# EasyEDA Pro project Keithley 2000 Omron SCAN V1.0.epro

# Schematic Keithley 2000 Omron SCAN V1.0
Board Name: Keithley 2000 SCAN V1.0; Create Date: 2026-03-19; Page Name: Main; Project Name: SCAN2000; Schematic Name: Keithley 2000 SCAN V1.0; Update Date: 2026-03-20; Company: EasyEDA.com; Page Size: A4; Version: V1.0
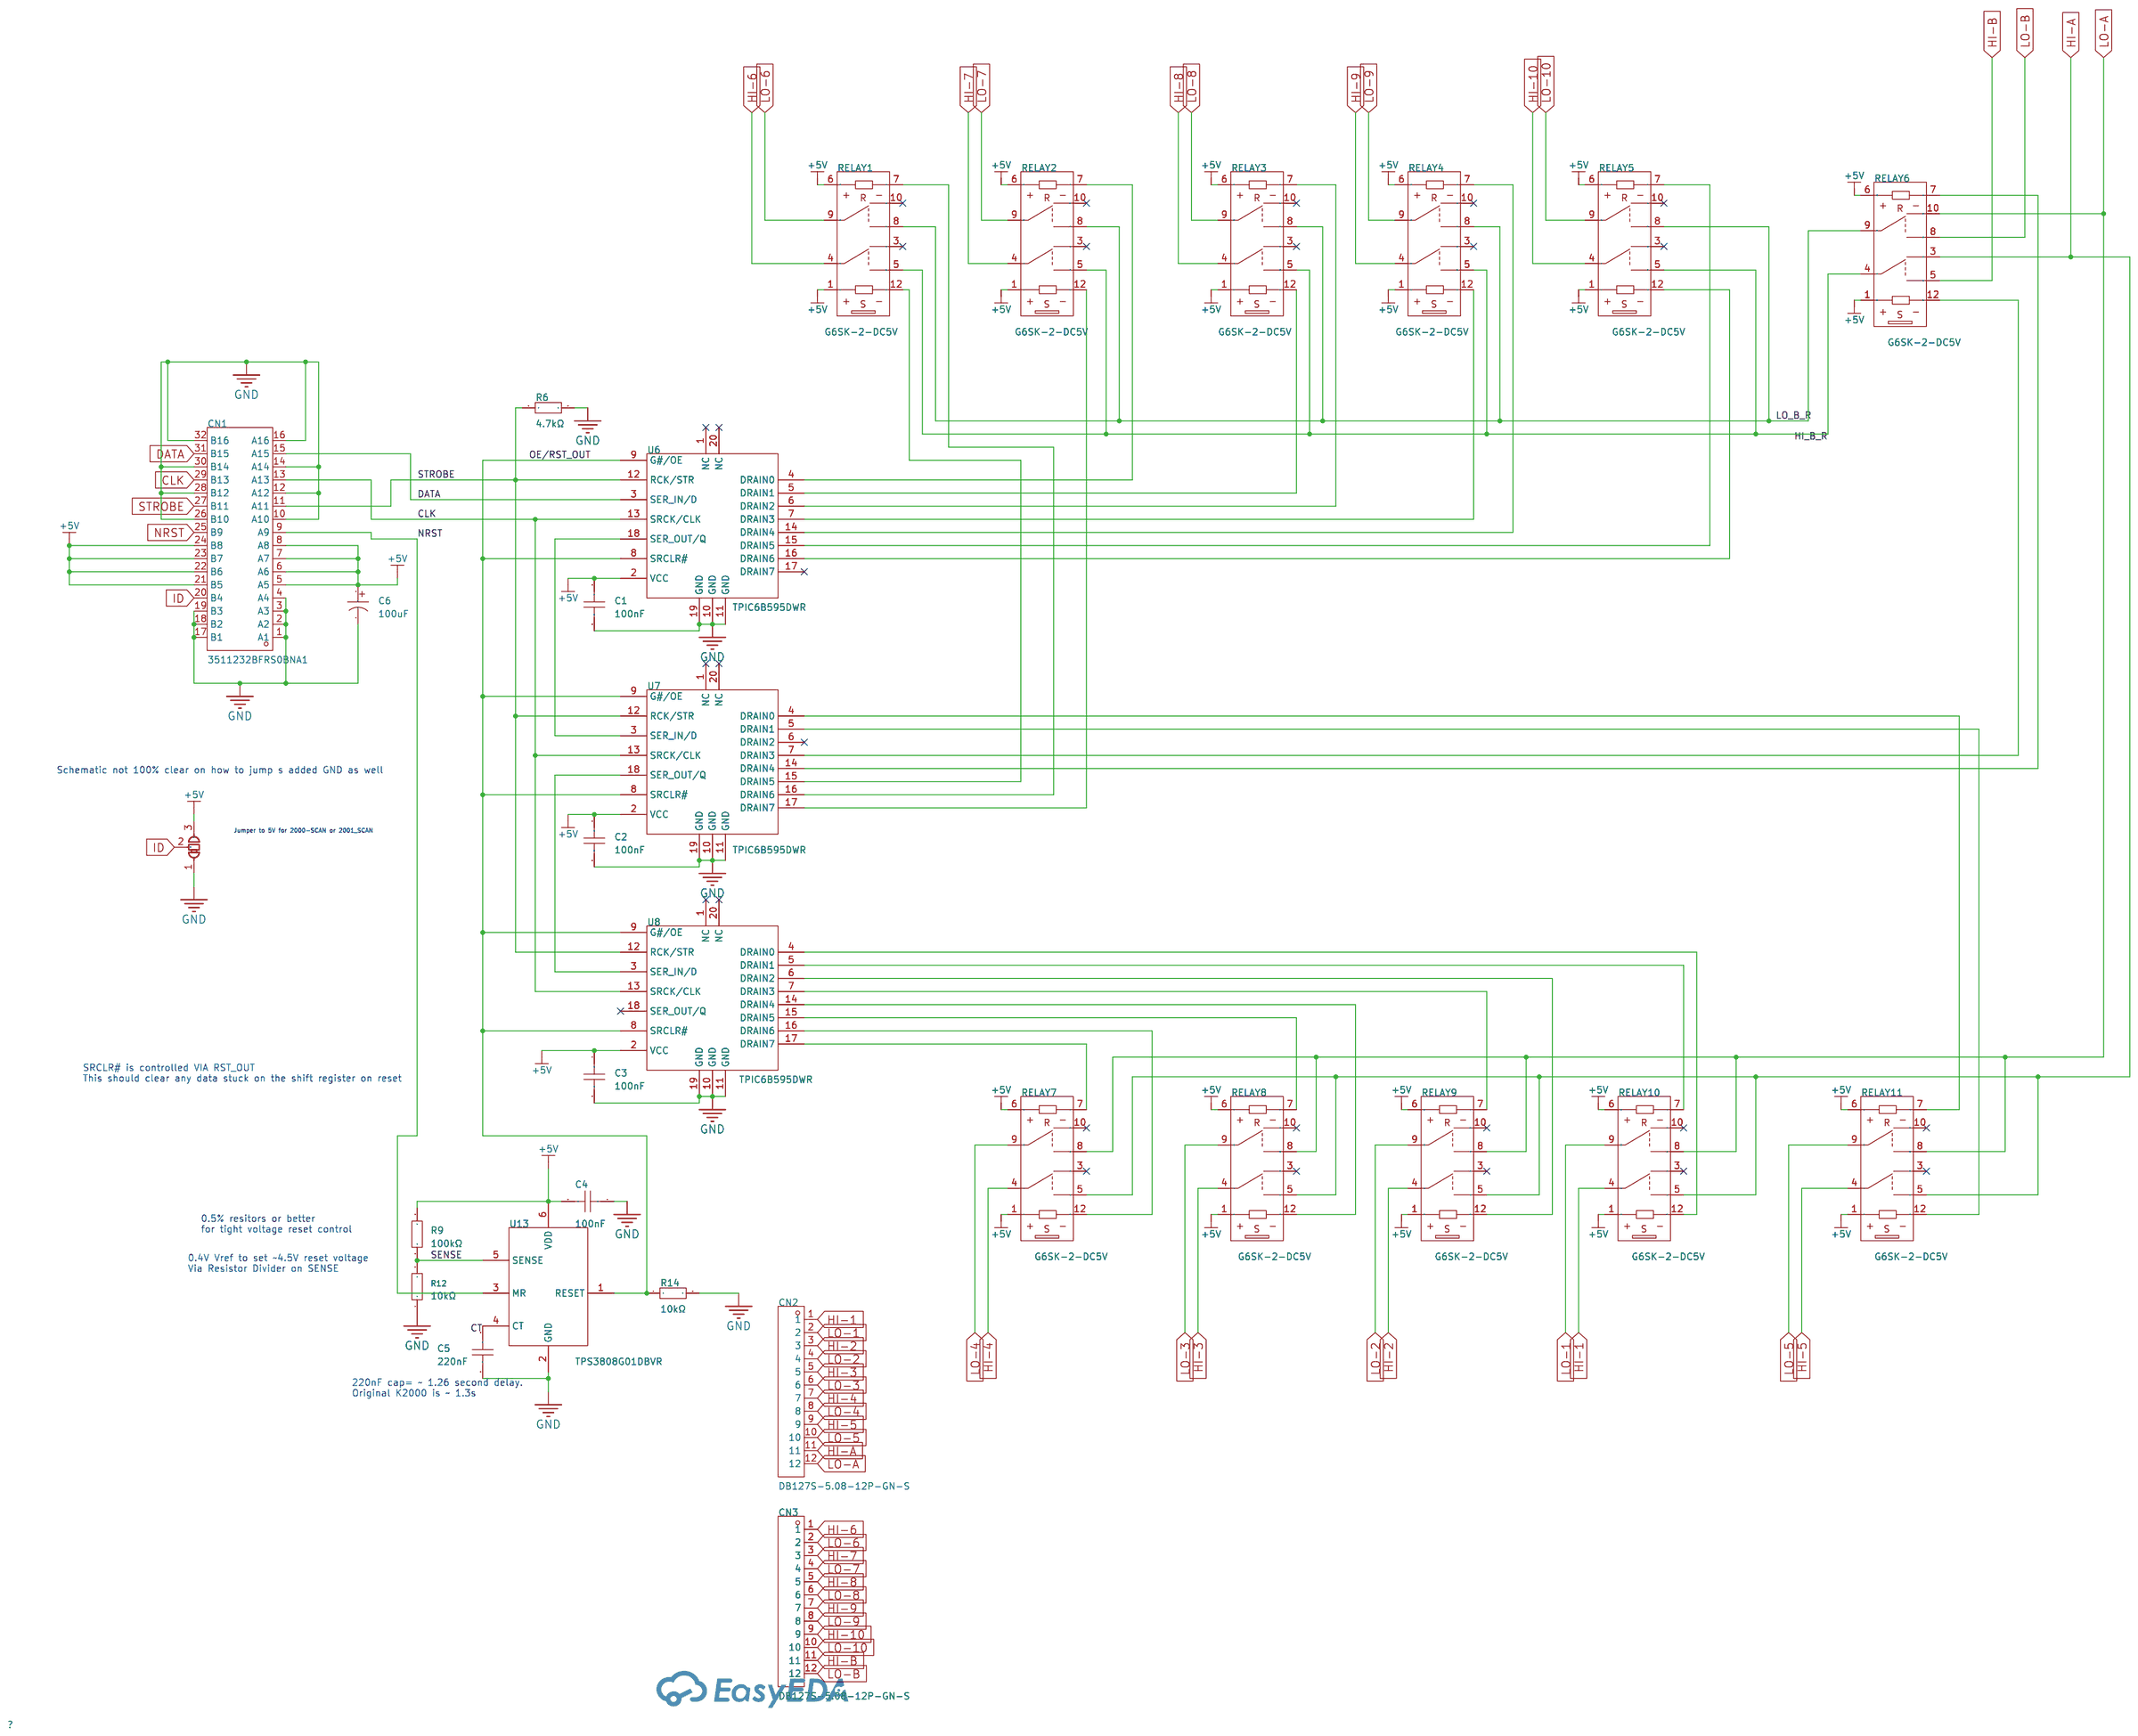
[diagram p0: schematic sheet]

## Parts
C1  100nF  [C0603]
C2  100nF  [C0603]
C3  100nF  [C0603]
C4  100nF  [C0603]
C5  220nF  [C0603]
C6  100uF  [CAP-TH_BD8.0-P3.50-D0.6-FD]
CN1  3511232BFRS0BNA1  [CONN-TH_3511232BFRS0BNA1]
CN2  DB127S-5.08-12P-GN-S  [CONN-TH_12P-P5.08_DB127S-5.08-12P-GN-S]
CN3  DB127S-5.08-12P-GN-S  [CONN-TH_12P-P5.08_DB127S-5.08-12P-GN-S]
JP1  SolderJumper_3_Bridged12  [Jumper:SolderJumper-3_P1.3mm_Bridged12_Pad1.0x1.5mm_NumberLabels]
R6  4.7kΩ  [R0603]
R9  100kΩ  [R0603]
R12  10kΩ  [R0603]
R14  10kΩ  [R0603]
RELAY1  G6SK-2-DC5V  [RELAY-TH_G6SK-2-XXX]
RELAY2  G6SK-2-DC5V  [RELAY-TH_G6SK-2-XXX]
RELAY3  G6SK-2-DC5V  [RELAY-TH_G6SK-2-XXX]
RELAY4  G6SK-2-DC5V  [RELAY-TH_G6SK-2-XXX]
RELAY5  G6SK-2-DC5V  [RELAY-TH_G6SK-2-XXX]
RELAY6  G6SK-2-DC5V  [RELAY-TH_G6SK-2-XXX]
RELAY7  G6SK-2-DC5V  [RELAY-TH_G6SK-2-XXX]
RELAY8  G6SK-2-DC5V  [RELAY-TH_G6SK-2-XXX]
RELAY9  G6SK-2-DC5V  [RELAY-TH_G6SK-2-XXX]
RELAY10  G6SK-2-DC5V  [RELAY-TH_G6SK-2-XXX]
RELAY11  G6SK-2-DC5V  [RELAY-TH_G6SK-2-XXX]
U6  TPIC6B595DWR  [SOIC-20_L13.0-W7.6-P1.27-LS10.3-BL]
U7  TPIC6B595DWR  [SOIC-20_L13.0-W7.6-P1.27-LS10.3-BL]
U8  TPIC6B595DWR  [SOIC-20_L13.0-W7.6-P1.27-LS10.3-BL]
U13  TPS3808G01DBVR  [SOT-23-6_L2.9-W1.6-P0.95-LS2.8-BR]

## Library data of the parts
C1-C4 = CL10B104KB8NNNC: Capacitance:100nF Tolerance:±10% Tolerance:±10% Voltage Rating:50V Temperature Coefficient:X7R; LCSC Part Name: 100nF ±10% 50V; Supplier Part: C1591; Manufacturer: SAMSUNG(三星); Supplier Footprint: 0603; JLCPCB Part Class: Extended Part; Datasheet: https://item.szlcsc.com/datasheet/CL10B104KB8NNNC/1943.html; Supplier: LCSC; Tolerance: ±10%; Voltage Rating: 50V; Temperature Coefficient: X7R
C5 = CL10B224KA8NNNC: Capacitance:220nF Tolerance:±10% Tolerance:±10% Voltage Rating:25V Temperature Coefficient:X7R; LCSC Part Name: 220nF ±10% 25V; Supplier Part: C21120; Manufacturer: SAMSUNG(三星); Supplier Footprint: 0603; JLCPCB Part Class: Basic Part; Datasheet: https://item.szlcsc.com/datasheet/CL10B224KA8NNNC/21832.html; Supplier: LCSC; Tolerance: ±10%; Voltage Rating: 25V; Temperature Coefficient: X7R
C6 = ERJ1HM101F12OT: Capacitance:100uF Tolerance:±20% Tolerance:±20% Voltage Rating:50V Ripple Current:950mA@100kHz Equivalent Series Resistance(ESR):120mΩ@100kHz Pin Spacing:3.5mm Diameter:8mm Height - Seated (Max):12mm Lifetime:10000hrs@105℃; LCSC Part Name: 100uF ±20% 50V; Supplier Part: C106559; Manufacturer: AISHI(艾华集团); Supplier Footprint: 插件,D8xL12mm; Datasheet: https://item.szlcsc.com/datasheet/ERJ1HM101F12OT/107775.html; Supplier: LCSC; Tolerance: ±20%; Voltage Rating: 50V; Ripple Current: 950mA@100kHz; Equivalent Series Resistance(ESR): 120mΩ@100kHz; Pin Spacing: 3.5mm; Diameter: 8mm; Height - Seated (Max): 12mm; Lifetime: 10000hrs@105℃
CN1 = 3511232BFRS0BNA1: Number of Pins:32P Pitch:2.54mm Mounting Type:Right Angle Number of Rows:2 Current Rating:3A Contact Material:Brass Contact Plating:Gold Operating Temperature:-40℃~+105℃ Operating Temperature:-40℃~+105℃; LCSC Part Name: PIN:32P 间距:2.54mm 弯插; Supplier Part: C963692; Manufacturer: JILN(锦凌); Supplier Footprint: 弯插,P=2.54mm; Datasheet: https://item.szlcsc.com/datasheet/3511232BFRS0BNA1/1048125.html; Supplier: LCSC; Number of Pins: 32P; Pitch: 2.54mm; Mounting Type: Right Angle; Number of Rows: 2; Current Rating: 3A; Contact Material: Brass; Contact Plating: Gold; Operating Temperature: -40℃~+105℃
CN2 CN3 = DB127S-5.08-12P-GN-S: Number of Positions or Pins:1x12P Pitch:5.08mm Color:Green Mounting Type:Through Hole Number of Pins:12P Number of Rows:1 Number of PINs Per Row:12 Screw Specification:M3 Current Rating:12A Voltage Rating (Max):300V Wire Gauge - AWG:14~26 Wire Gauge - mm2; LCSC Part Name: 1x12P 5.08mm 直插 排数:1 每排P数:12; Supplier Part: C18198311; Manufacturer: DORABO(地博电气); Supplier Footprint: 插件,P=5.08mm; JLCPCB Part Class: Extended Part; Datasheet: https://item.szlcsc.com/datasheet/DB127S-5.08-12P-GN-S/19349685.html; Supplier: LCSC; Number of Positions or Pins: 1x12P; Pitch: 5.08mm; Color: Green; Mounting Type: Through Hole; Number of Pins: 12P; Number of Rows: 1; Number of PINs Per Row: 12; Screw Specification: M3; Current Rating: 12A; Voltage Rating (Max): 300V; Wire Gauge - AWG: 14~26; Wire Gauge - mm2: 1.5; Operating Temperature: -40℃~+105℃
JP1 = Jumper_SolderJumper_3_Bridged12: 3-pole Solder Jumper, pins 1+2 closed/bridged; Attribute1: 1; Attribute2: 3; DNP: 1
R6 = RC0603FR-074K7L: Type:Thick Film Resistor Resistance:4.7kΩ Tolerance:±1% Tolerance:±1% Power(Watts):100mW Voltage-Supply(Max):75V Temperature Coefficient:±100ppm/℃ Temperature Coefficient:±100ppm/℃ Operating Temperature:-55℃~+155℃ Operating Temperature:-55℃~+155℃; LCSC Part Name: 厚膜电阻 4.7kΩ ±1% 100mW; Supplier Part: C99782; Manufacturer: YAGEO(国巨); Supplier Footprint: 0603; JLCPCB Part Class: Extended Part; Datasheet: https://item.szlcsc.com/datasheet/RC0603FR-074K7L/100996.html; Supplier: LCSC; Type: Thick Film Resistor; Tolerance: ±1%; Power(Watts): 100mW; Voltage-Supply(Max): 75V; Temperature Coefficient: ±100ppm/℃; Operating Temperature: -55℃~+155℃
R9 = AR03DTCX1003: Type:Thin Film Resistor Resistance:100kΩ Tolerance:±0.5% Tolerance:±0.5% Power(Watts):100mW Voltage-Supply(Max):75V Temperature Coefficient:±25ppm/℃ Temperature Coefficient:±25ppm/℃ Operating Temperature:-55℃~+155℃ Operating Temperature:-55℃~+155℃; LCSC Part Name: 薄膜电阻 100kΩ ±0.5% 100mW; Supplier Part: C319967; Manufacturer: Viking(光颉); Supplier Footprint: 0603; Datasheet: https://item.szlcsc.com/datasheet/AR03DTCX1003/301037.html; Supplier: LCSC; Type: Thin Film Resistor; Tolerance: ±0.5%; Power(Watts): 100mW; Voltage-Supply(Max): 75V; Temperature Coefficient: ±25ppm/℃; Operating Temperature: -55℃~+155℃
R12 = 0603WAD1002T5E: Type:Thick Film Resistor Resistance:10kΩ Tolerance:±0.5% Tolerance:±0.5% Power(Watts):100mW Voltage-Supply(Max):75V Temperature Coefficient:±100ppm/℃ Temperature Coefficient:±100ppm/℃ Operating Temperature:-55℃~+155℃ Operating Temperature:-55℃~+155℃; LCSC Part Name: 10kΩ ±0.5% 100mW 厚膜电阻; Supplier Part: C167144; Manufacturer: UNI-ROYAL(厚声); Supplier Footprint: 0603; JLCPCB Part Class: Extended Part; Datasheet: https://item.szlcsc.com/datasheet/0603WAD1002T5E/178527.html; Supplier: LCSC; Type: Thick Film Resistor; Tolerance: ±0.5%; Power(Watts): 100mW; Voltage-Supply(Max): 75V; Temperature Coefficient: ±100ppm/℃; Operating Temperature: -55℃~+155℃
R14 = RC0603FR-0710KL: Type:Thick Film Resistors Resistance: Tolerance:±1% Tolerance:±1% Power(Watts): Overload Voltage (Max): Temperature Coefficient:±100ppm/℃ Temperature Coefficient:±100ppm/℃ Operating Temperature Range:-55℃~+155℃ Operating Temperature Range:-55℃~+155℃; LCSC Part Name: 厚膜电阻 10kΩ ±1% 100mW; Supplier Part: C98220; Manufacturer: YAGEO(国巨); Supplier Footprint: 0603; JLCPCB Part Class: Extended Part; Datasheet: https://atta.szlcsc.com/upload/public/pdf/source/20180927/C295883_E8D83085EA81BD7DE0B2B681138C15EE.pdf; Supplier: LCSC; Type: Thick Film Resistors; Tolerance: ±1%; Temperature Coefficient: ±100ppm/℃; Operating Temperature Range: -55℃~+155℃
RELAY1-RELAY11 = G6SK-2-DC5V: Supplier Part: C2931106; Manufacturer: OMRON(欧姆龙); Supplier Footprint: DIP,14.8x7.3mm; JLCPCB Part Class: Extended Part; Supplier: LCSC
U6-U8 = TPIC6B595DWR: Function:Serial-to-Serial or Parallel Voltage - Supply:4.5V~5.5V Voltage - Supply:4.5V~5.5V Clock Frequency:- Number of Elements:1 Number of Bits per Element:- Output Type:Open Drain Series:TPIC Operating Temperature:-40℃~+125℃ Operating Temperature:-40℃~; LCSC Part Name: 开路漏极输出 8位串行至串行或并行移位寄存器; Supplier Part: C7094; Manufacturer: TI(德州仪器); Supplier Footprint: SOIC-20-300mil; JLCPCB Part Class: Extended Part; Datasheet: https://www.ti.com/cn/lit/gpn/tpic6b595; Supplier: LCSC; Function: Serial-to-Serial or Parallel; Voltage - Supply: 4.5V~5.5V; Number of Elements: 1; Output Type: Open Drain; Series: TPIC; Operating Temperature: -40℃~+125℃
U13 = TPS3808G01DBVR: ChipType:Voltage monitor Output Type:Open Drain Voltage - Supply:1.7V~6.5V Voltage - Supply:1.7V~6.5V Reset Active Level:Active Low Threshold Voltage:405mV Number of Voltages Monitored:1 Manual Reset:Yes Watchdog:No Reset Timeout:20us Operating Temperatur; LCSC Part Name: 低静态电流可编程延迟监控电路; Supplier Part: C19653; Manufacturer: TI(德州仪器); Supplier Footprint: SOT-23-6; JLCPCB Part Class: Extended Part; Datasheet: https://www.ti.com/cn/lit/gpn/tps3808; Supplier: LCSC; ChipType: Voltage monitor; Output Type: Open Drain; Voltage - Supply: 1.7V~6.5V; Reset Active Level: Active Low; Threshold Voltage: 405mV; Number of Voltages Monitored: 1; Manual Reset: Yes; Watchdog: No; Reset Timeout: 20us; Operating Temperature: -40℃~+125℃@(Tj)

## Nets
+5V: C1.1 C2.1 C3.1 C4.2 C6.1 CN1.5(A5) CN1.6(A6) CN1.7(A7) CN1.8(A8) CN1.21(B5) CN1.22(B6) CN1.23(B7) CN1.24(B8) JP1.3(B) R9.2 RELAY1.1 RELAY1.6 RELAY2.1 RELAY2.6 RELAY3.1 RELAY3.6 RELAY4.1 RELAY4.6 RELAY5.1 RELAY5.6 RELAY6.1 RELAY6.6 RELAY7.1 RELAY7.6 RELAY8.1 RELAY8.6 RELAY9.1 RELAY9.6 RELAY10.1 RELAY10.6 RELAY11.1 RELAY11.6 U6.2(VCC) U7.2(VCC) U8.2(VCC) U13.6(VDD)
GND: C1.2 C2.2 C3.2 C4.1 C5.2 C6.2 CN1.1(A1) CN1.2(A2) CN1.3(A3) CN1.4(A4) CN1.10(A10) CN1.12(A12) CN1.14(A14) CN1.16(A16) CN1.17(B1) CN1.18(B2) CN1.19(B3) CN1.26(B10) CN1.28(B12) CN1.30(B14) CN1.32(B16) JP1.1(A) R6.2 R12.1 R14.2 U6.10(GND) U6.11(GND) U6.19(GND) U7.10(GND) U7.11(GND) U7.19(GND) U8.10(GND) U8.11(GND) U8.19(GND) U13.2(GND)
CLK: CN1.13(A13) CN1.29(B13) U6.13(SRCK/CLK) U7.13(SRCK/CLK) U8.13(SRCK/CLK)
CT: C5.1 U13.4(CT)
DATA: CN1.15(A15) CN1.31(B15) U6.3(SER IN/D)
HI-1: CN2.1 RELAY10.4
HI-2: CN2.3 RELAY9.4
HI-3: CN2.5 RELAY8.4
HI-4: CN2.7 RELAY7.4
HI-5: CN2.9 RELAY11.4
HI-6: CN3.1 RELAY1.4
HI-7: CN3.3 RELAY2.4
HI-8: CN3.5 RELAY3.4
HI-9: CN3.7 RELAY4.4
HI-10: CN3.9 RELAY5.4
HI-A: CN2.11 RELAY6.3 RELAY7.5 RELAY8.5 RELAY9.5 RELAY10.5 RELAY11.5
HI-B: CN3.11 RELAY6.5
HI_B_R: RELAY1.5 RELAY2.5 RELAY3.5 RELAY4.5 RELAY5.5 RELAY6.4
ID: CN1.20(B4) JP1.2(C)
LO-1: CN2.2 RELAY10.9
LO-2: CN2.4 RELAY9.9
LO-3: CN2.6 RELAY8.9
LO-4: CN2.8 RELAY7.9
LO-5: CN2.10 RELAY11.9
LO-6: CN3.2 RELAY1.9
LO-7: CN3.4 RELAY2.9
LO-8: CN3.6 RELAY3.9
LO-9: CN3.8 RELAY4.9
LO-10: CN3.10 RELAY5.9
LO-A: CN2.12 RELAY6.10 RELAY7.8 RELAY8.8 RELAY9.8 RELAY10.8 RELAY11.8
LO-B: CN3.12 RELAY6.8
LO_B_R: RELAY1.8 RELAY2.8 RELAY3.8 RELAY4.8 RELAY5.8 RELAY6.9
NRST: CN1.9(A9) CN1.25(B9) U13.3(MR)
OE/RST_OUT: R14.1 U6.8(SRCLR#) U6.9(G#/OE) U7.8(SRCLR#) U7.9(G#/OE) U8.8(SRCLR#) U8.9(G#/OE) U13.1(RESET)
SENSE: R9.1 R12.2 U13.5(SENSE)
STROBE: CN1.11(A11) CN1.27(B11) R6.1 U6.12(RCK/STR) U7.12(RCK/STR) U8.12(RCK/STR)
$RELAY1_7: RELAY1.7 U7.16(DRAIN6)
$RELAY1_12: RELAY1.12 U7.15(DRAIN5)
$RELAY2_7: RELAY2.7 U6.4(DRAIN0)
$RELAY2_12: RELAY2.12 U7.17(DRAIN7)
$RELAY3_7: RELAY3.7 U6.6(DRAIN2)
$RELAY3_12: RELAY3.12 U6.5(DRAIN1)
$RELAY4_7: RELAY4.7 U6.14(DRAIN4)
$RELAY4_12: RELAY4.12 U6.7(DRAIN3)
$RELAY5_7: RELAY5.7 U6.15(DRAIN5)
$RELAY5_12: RELAY5.12 U6.16(DRAIN6)
$RELAY6_7: RELAY6.7 U7.14(DRAIN4)
$RELAY6_12: RELAY6.12 U7.7(DRAIN3)
$RELAY7_7: RELAY7.7 U8.17(DRAIN7)
$RELAY7_12: RELAY7.12 U8.16(DRAIN6)
$RELAY8_7: RELAY8.7 U8.15(DRAIN5)
$RELAY8_12: RELAY8.12 U8.14(DRAIN4)
$RELAY9_7: RELAY9.7 U8.7(DRAIN3)
$RELAY9_12: RELAY9.12 U8.6(DRAIN2)
$RELAY10_7: RELAY10.7 U8.5(DRAIN1)
$RELAY10_12: RELAY10.12 U8.4(DRAIN0)
$RELAY11_7: RELAY11.7 U7.4(DRAIN0)
$RELAY11_12: RELAY11.12 U7.5(DRAIN1)
$U6_18: U6.18(SER OUT/Q) U7.3(SER IN/D)
$U7_18: U7.18(SER OUT/Q) U8.3(SER IN/D)

Not connected (* = marked no-connect by the designer): RELAY1 3* 10*; RELAY2 3* 10*; RELAY3 3* 10*; RELAY4 3* 10*; RELAY5 3* 10*; RELAY7 3* 10*; RELAY8 3* 10*; RELAY9 3* 10*; RELAY10 3* 10*; RELAY11 3* 10*; U6 1(NC)* 17(DRAIN7)* 20(NC)*; U7 1(NC)* 6(DRAIN2)* 20(NC)*; U8 1(NC)* 18(SER OUT/Q)* 20(NC)*

## Notes on the sheet
- Schematic not 100% clear on how to jump s added GND as well
- Jumper to 5V for 2000-SCAN or 2001_SCAN
- SRCLR# is controlled VIA RST_OUT
  This should clear any data stuck on the shift register on reset
- 0.5% resitors or better
  for tight voltage reset control
- 0.4V Vref to set ~4.5V reset voltage
  Via Resistor Divider on SENSE
- 220nF cap= ~ 1.26 second delay.
  Original K2000 is ~ 1.3s

# Board Keithley 2000 Omron SCAN V1.0
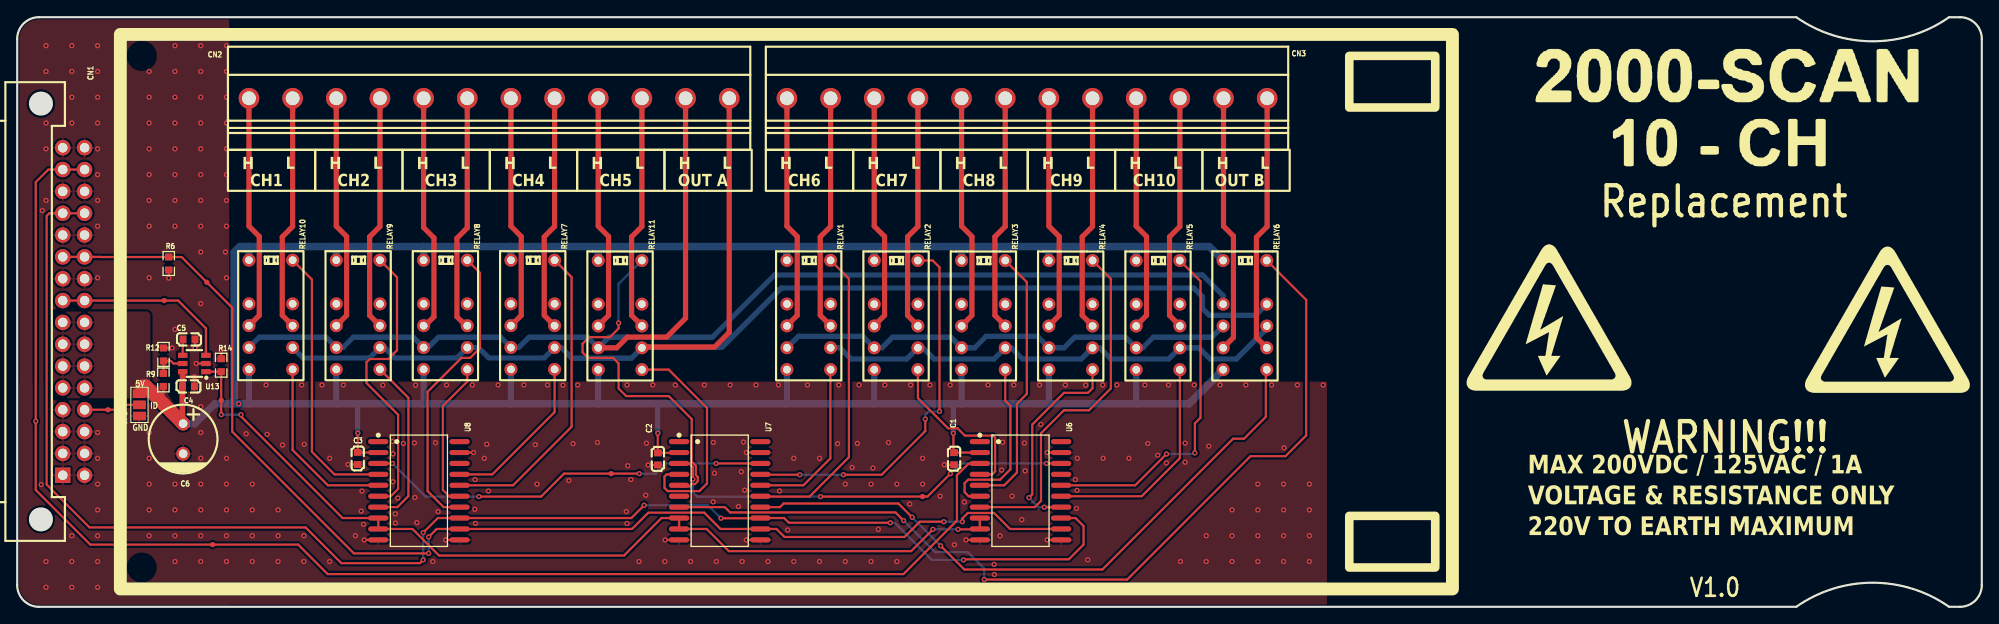
[diagram p1: board, top side]
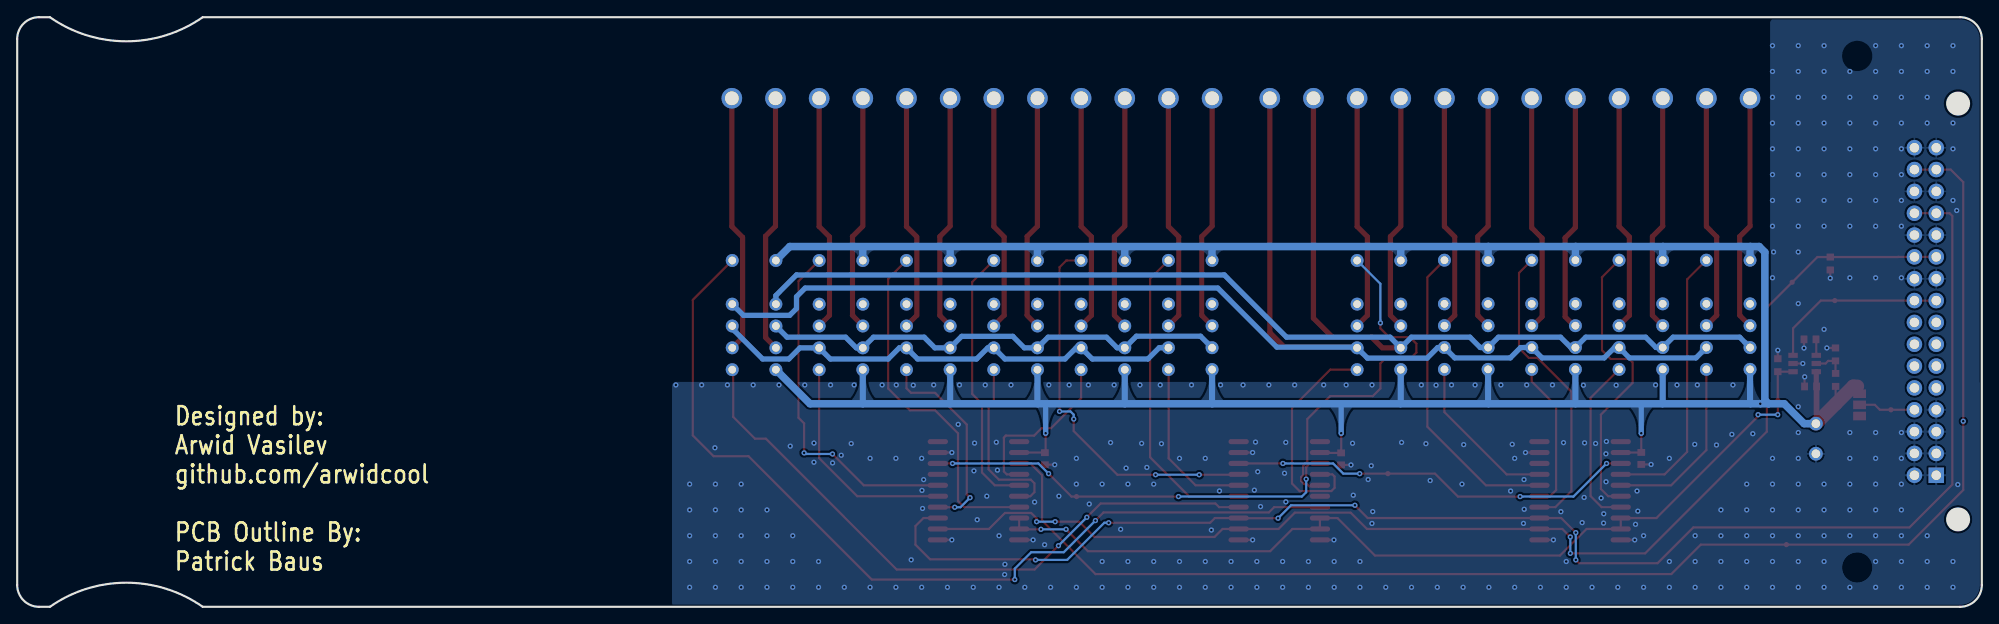
[diagram p2: board, bottom side, seen from below]

Outline 228.6 x 68.58 mm; copper layers: Top Layer, Bottom Layer. Coordinates in mm from the lower left corner of the outline.
Outline path: 0,66.04 arc(0.74,67.84) 2.54,68.58 207.01,68.58 arc(215.9,65.78) 224.79,68.58 226.06,68.58 arc(227.86,67.84) 228.6,66.04 228.6,2.54 arc(227.86,0.74) 226.06,0 224.79,0 arc(215.9,2.8) 207.01,0 2.54,0 arc(0.74,0.74) 0,2.54 0,66.04
Stack: Top Layer 0.035mm / Dielectric1 1.51mm FR4 er 4.5 / Bottom Layer 0.035mm

## Design rules (mm)
template: JLCPCB Capability(Two Layers Board)
spacing copperThickness1oz (default): track to track 0.102, other pairs 0.152 to 0.3
spacing copperThickness2oz: track to track 0.203, other pairs 0.152 to 0.3
track width copperThickness1oz (default): min 0.127, default 0.254, max 2.54
track width copperThickness2oz: min 0.203, default 0.254, max 2.54
differential pair differentialPair (default): width min 0.127, default 0.254, max 2.54; gap min 0.152, default 0.152
via viaSize (default): diameter min 0.5, default 0.61, max 10; hole min 0.3, default 0.305, max 6.3

## Placement (name value [footprint] x y rotation side)
C1  100nF  [C0603]  109.02 17.23 270 top
C2  100nF  [C0603]  74.55 17.2 270 top
C3  100nF  [C0603]  39.62 17.26 270 top
C4  100nF  [C0603]  19.93 25.63 180 top
C5  220nF  [C0603]  19.99 31.11 0 top
C6  100uF  [CAP-TH_BD8.0-P3.50-D0.6-FD]  19.31 19.55 270 top
CN1  3511232BFRS0BNA1  [CONN-TH_3511232BFRS0BNA1]  6.57 34.35 270 top
CN2  DB127S-5.08-12P-GN-S  [CONN-TH_12P-P5.08_DB127S-5.08-12P-GN-S]  54.91 59.15 0 top
CN3  DB127S-5.08-12P-GN-S  [CONN-TH_12P-P5.08_DB127S-5.08-12P-GN-S]  117.5 59.15 0 top
JP1  SolderJumper_3_Bridged12  [Jumper:SolderJumper-3_P1.3mm_Bridged12_Pad1.0x1.5mm_NumberLabels]  14.22 23.49 90 top
NOREF  -  [Pad_e19981]  17.1 35.62 0 top
NOREF#2  -  [Pad_e20018]  69.11 15.49 0 top
NOREF#3  -  [Pad_e20005]  22.74 7.23 0 top
NOREF#4  -  [Pad_e19993]  10.57 22.92 0 top
NOREF#5  -  [Pad_e20012]  105.34 12.82 0 top
NOREF#6  -  [Pad_e19987]  22.06 37.75 0 top
NOREF#7  -  [Pad_e19999]  23.74 24.01 0 top
R6  4.7kΩ  [R0603]  17.63 39.93 270 top
R9  100kΩ  [R0603]  17.01 26.39 270 top
R12  10kΩ  [R0603]  17.03 29.36 270 top
R14  10kΩ  [R0603]  23.74 28.1 90 top
RELAY1  G6SK-2-DC5V  [RELAY-TH_G6SK-2-XXX]  92.11 33.95 270 top
RELAY2  G6SK-2-DC5V  [RELAY-TH_G6SK-2-XXX]  102.27 33.93 270 top
RELAY3  G6SK-2-DC5V  [RELAY-TH_G6SK-2-XXX]  112.43 33.93 270 top
RELAY4  G6SK-2-DC5V  [RELAY-TH_G6SK-2-XXX]  122.58 33.93 270 top
RELAY5  G6SK-2-DC5V  [RELAY-TH_G6SK-2-XXX]  132.75 33.93 270 top
RELAY6  G6SK-2-DC5V  [RELAY-TH_G6SK-2-XXX]  142.86 33.93 270 top
RELAY7  G6SK-2-DC5V  [RELAY-TH_G6SK-2-XXX]  59.99 33.97 270 top
RELAY8  G6SK-2-DC5V  [RELAY-TH_G6SK-2-XXX]  49.83 33.97 270 top
RELAY9  G6SK-2-DC5V  [RELAY-TH_G6SK-2-XXX]  39.67 33.97 270 top
RELAY10  G6SK-2-DC5V  [RELAY-TH_G6SK-2-XXX]  29.51 33.97 270 top
RELAY11  G6SK-2-DC5V  [RELAY-TH_G6SK-2-XXX]  70.15 33.94 270 top
U6  TPIC6B595DWR  [SOIC-20_L13.0-W7.6-P1.27-LS10.3-BL]  116.74 13.5 270 top
U7  TPIC6B595DWR  [SOIC-20_L13.0-W7.6-P1.27-LS10.3-BL]  81.74 13.5 270 top
U8  TPIC6B595DWR  [SOIC-20_L13.0-W7.6-P1.27-LS10.3-BL]  46.74 13.5 270 top
U13  TPS3808G01DBVR  [SOT-23-6_L2.9-W1.6-P0.95-LS2.8-BR]  20.61 28.3 0 top

## Footprints (pads in the part's own frame, mm; a bottom-side part is the same pattern mirrored in y, then rotated)
C0603
  rect 0.8x0.9 smd: 1(-0.7,0) 2(0.7,0)
CAP-TH_BD8.0-P3.50-D0.6-FD
  round 1.6 hole 1: 1(-1.75,0) 2(1.75,0)
CONN-TH_12P-P5.08_DB127S-5.08-12P-GN-S
  round 2.4 hole 1.6: 1(-27.94,0) 2(-22.86,0) 3(-17.78,0) 4(-12.7,0) 5(-7.62,0) 6(-2.54,0) 7(2.54,0) 8(7.62,0) 9(12.7,0) 10(17.78,0) 11(22.86,0) 12(27.94,0)
CONN-TH_3511232BFRS0BNA1
  rect 1.8x1.8 hole 1.1: 1(19.05,-1.27)
  round 1.8 hole 1.1: 2(16.51,-1.27) 3(13.97,-1.27) 4(11.43,-1.27) 5(8.89,-1.27) 6(6.35,-1.27) 7(3.81,-1.27) 8(1.27,-1.27) 9(-1.27,-1.27) 10(-3.81,-1.27) 11(-6.35,-1.27) 12(-8.89,-1.27) 13(-11.43,-1.27) 14(-13.97,-1.27) 15(-16.51,-1.27) 16(-19.05,-1.27) 17(19.05,1.27) 18(16.51,1.27) 19(13.97,1.27) 20(11.43,1.27) 21(8.89,1.27) 22(6.35,1.27) 23(3.81,1.27) 24(1.27,1.27) 25(-1.27,1.27) 26(-3.81,1.27) 27(-6.35,1.27) 28(-8.89,1.27) 29(-11.43,1.27) 30(-13.97,1.27) 31(-16.51,1.27) 32(-19.05,1.27)
Jumper:SolderJumper-3_P1.3mm_Bridged12_Pad1.0x1.5mm_NumberLabels
  rect 1x1.5 smd: 1(-1.3,0) 2(0,0) 3(1.3,0)
Pad_e19981
  round 0.61 smd: TP1(0,0)
Pad_e19987
  round 0.61 smd: TP2(0,0)
Pad_e19993
  round 0.61 smd: TP3(0,0)
Pad_e19999
  round 0.61 smd: TP4(0,0)
Pad_e20005
  round 0.61 smd: TP5(0,0)
Pad_e20012
  round 0.61 smd: TP6(0,0)
Pad_e20018
  round 0.61 smd: TP7(0,0)
R0603
  rect 0.806x0.864 smd: 1(-0.753,0) 2(0.753,0)
RELAY-TH_G6SK-2-XXX
  round 1.5 hole 0.9: 1(-6.35,-2.54) 3(-1.27,-2.54) 4(1.27,-2.54) 5(3.81,-2.54) 6(6.35,-2.54) 7(6.35,2.54) 8(3.81,2.54) 9(1.27,2.54) 10(-1.27,2.54) 12(-6.35,2.54)
SOIC-20_L13.0-W7.6-P1.27-LS10.3-BL
  oval 0.595x2.36 smd: 1(-5.715,-4.73) 2(-4.445,-4.73) 3(-3.175,-4.73) 4(-1.905,-4.73) 5(-0.635,-4.73) 6(0.635,-4.73) 7(1.905,-4.73) 8(3.175,-4.73) 9(4.445,-4.73) 10(5.715,-4.73) 11(5.715,4.73) 12(4.445,4.73) 13(3.175,4.73) 14(1.905,4.73) 15(0.635,4.73) 16(-0.635,4.73) 17(-1.905,4.73) 18(-3.175,4.73) 19(-4.445,4.73) 20(-5.715,4.73)
SOT-23-6_L2.9-W1.6-P0.95-LS2.8-BR
  rect 1.1x0.6 smd: 1(1.35,-0.95) 2(1.35,0) 3(1.35,0.95) 4(-1.35,0.95) 5(-1.35,0) 6(-1.35,-0.95)

## Nets
As in the schematic, except:
$U6_18: NOREF#5.TP6 U6.18 U7.3
$U7_18: NOREF#2.TP7 U7.18 U8.3
DATA: CN1.15 CN1.31 NOREF#3.TP5 U6.3
ID: CN1.20 JP1.2 NOREF#4.TP3
NRST: CN1.9 CN1.25 NOREF.TP1 U13.3
OE/RST_OUT: NOREF#7.TP4 R14.1 U6.8 U6.9 U7.8 U7.9 U8.8 U8.9 U13.1
STROBE: CN1.11 CN1.27 NOREF#6.TP2 R6.1 U6.12 U7.12 U8.12

Pads without a net: RELAY1 3 10; RELAY2 3 10; RELAY3 3 10; RELAY4 3 10; RELAY5 3 10; RELAY7 3 10; RELAY8 3 10; RELAY9 3 10; RELAY10 3 10; RELAY11 3 10; U6 1 17 20; U7 1 6 20; U8 1 18 20

## Via types
v1: diameter 0.61, hole 0.305, Top Layer to Bottom Layer, 380 vias

## Routing (per net, layer and track width the routed paths; a pad name or vN(x,y) marks a point on that pad's centre or on a via; arc(x,y) is an arc through that point)
+5V: length 353.8
  Top Layer w0.254: 17.01,22.84 17.01,25.64 ; U6.2 109.03,17.94 ; 109.03,17.94 C1.1 ; 109.03,17.94 108.93,18.04 v1(108.93,20.19) ; v1(39.62,20.19) 39.62,17.9 39.67,17.94 U8.2 ; v1(74.54,20.19) 74.54,17.91 C2.1 76.97,17.9 U7.2
  Top Layer w0.61: 19.26,25.67 U13.6
  Top Layer w0.66: 19.23,21.38 C4.2
  Top Layer w1.575: C6.1 19.23,21.38 17.01,23.6 14.96,25.65 14.48,25.65
  Bottom Layer w0.61: v1(39.62,20.19) 39.62,23.59 ; v1(108.93,20.19) 108.93,23.59 ; v1(74.54,20.19) 74.54,23.59
  Bottom Layer w0.711: 47.28,23.62 47.29,23.63 RELAY8.6 ; 37.12,23.62 37.13,23.63 RELAY9.6 ; 89.57,23.61 RELAY1.6 ; 57.44,23.62 57.45,23.63 RELAY7.6 ; RELAY11.6 67.61,23.6 67.59,23.58 ; RELAY2.6 99.72,23.6 99.71,23.58 ; 26.96,23.62 26.97,23.63 RELAY10.6 ; RELAY3.6 109.89,23.59 109.87,23.58 ; 89.55,23.6 89.56,23.61 ; 130.21,27.58 130.21,23.59 130.19,23.58 ; 120.03,23.58 120.04,23.59 RELAY4.6
  Bottom Layer w0.864: 130.17,41.87 130.21,41.83 RELAY5.1 ; RELAY11.1 67.61,41.84 67.58,41.87 ; 24.81,23.62 22.99,23.62 20.67,21.3 C6.1 ; 24.81,23.62 25.25,24.05 25.25,41.25 25.9,41.9 26.94,41.9 ; 24.81,23.62 v1(25.78,23.62) 136.35,23.62 RELAY6.6 ; RELAY10.1 26.97,41.87 26.94,41.9 ; 26.94,41.9 37.1,41.9 ; RELAY9.1 37.13,41.87 37.1,41.9 ; 37.1,41.9 47.26,41.9 ; 47.26,41.9 57.42,41.9 ; 47.26,41.9 47.29,41.87 RELAY8.1 ; 57.42,41.9 57.45,41.87 RELAY7.1 ; 57.42,41.9 138.7,41.9 RELAY6.1 ; 120.01,41.87 120.04,41.84 RELAY4.1 ; RELAY3.1 109.89,41.84 109.85,41.87 ; 89.53,41.88 89.57,41.85 RELAY1.1 ; RELAY2.1 99.72,41.84 99.69,41.87
GND: length 24.2
  Top Layer w0.254: U6.10 v1(110.39,7.78) ; R6.2 v1(17.63,38.22) ; U8.10 v1(40.39,7.78) ; C1.2 v1(107.87,16.53) ; U8.11 v1(49.85,7.78) ; R12.1 v1(18.04,30.11) ; U6.11 v1(119.85,7.78) ; U13.2 v1(20.83,28.3) ; U6.19 v1(119.85,17.94) ; 23.74,28.86 v1(23.74,29.84) ; 74.55,16.5 v1(73.41,16.5) ; U7.19 v1(84.85,17.94) ; C4.1 20.63,26.66 ; C3.2 v1(38.48,16.56) ; C5.2 v1(20.69,30.09) ; U7.11 v1(84.85,7.78) ; U7.10 v1(75.39,7.78) ; U8.19 v1(53.1,17.94)
  vias: v1(2.79,14.22) v1(2.92,46.1) v1(3.36,65.27) v1(3.36,62.27) v1(3.36,56.27) v1(3.36,53.27) v1(3.36,47.27) v1(3.36,5.27) v1(3.36,2.27) v1(6.36,65.27) v1(6.36,62.27) v1(6.36,59.27) v1(6.36,56.27) v1(6.36,8.27) v1(6.36,5.27) v1(6.36,2.27) v1(9.36,65.27) v1(9.36,62.27) v1(9.36,59.27) v1(9.36,56.27) v1(9.36,53.27) v1(9.36,50.27) v1(9.36,47.27) v1(9.36,44.27) v1(9.36,38.27) v1(9.36,20.27) v1(9.36,17.27) v1(9.36,14.27) v1(9.36,11.27) v1(9.36,8.27) v1(9.36,5.27) v1(9.36,2.27) v1(12.36,65.27) v1(12.36,62.27) v1(12.36,59.27) v1(12.36,56.27) v1(12.36,53.27) v1(12.36,50.27) v1(12.36,47.27) v1(12.36,44.27) v1(12.36,38.27) v1(12.36,20.27) v1(12.36,17.27) v1(12.36,14.27) v1(12.36,11.27) v1(12.36,8.27) v1(12.36,5.27) v1(12.36,2.27) v1(15.36,62.27) v1(15.36,59.27) v1(15.36,56.27) v1(15.36,53.27) v1(15.36,50.27) v1(15.36,47.27) v1(15.36,44.27) v1(15.36,38.27) v1(15.36,20.27) v1(15.36,17.27) v1(15.36,14.27) v1(15.36,11.27) v1(15.36,8.27) v1(15.36,2.27) v1(18.36,65.27) v1(18.36,62.27) v1(18.36,59.27) v1(18.36,56.27) v1(18.36,53.27) v1(18.36,50.27) v1(18.36,47.27) v1(18.36,44.27) v1(18.36,32.27) v1(18.36,14.27) v1(18.36,11.27) v1(18.36,8.27) v1(18.36,5.27) v1(18.36,2.27) v1(20.61,26.75) v1(21.36,65.27) v1(21.36,62.27) v1(21.36,59.27) v1(21.36,56.27) v1(21.36,53.27) v1(21.36,50.27) v1(21.36,47.27) v1(21.36,44.27) v1(21.36,41.27) v1(21.36,35.27) v1(21.36,23.27) v1(21.36,20.27) v1(21.36,17.27) v1(21.36,14.27) v1(21.36,11.27) v1(21.36,8.27) v1(21.36,5.27) v1(21.36,2.27) v1(24.23,41.27) v1(24.36,65.27) v1(24.36,62.27) v1(24.36,59.27) v1(24.36,56.27) v1(24.36,53.27) v1(24.36,50.27) v1(24.36,47.27) v1(24.36,44.27) v1(24.36,38.27) v1(24.36,17.27) v1(24.36,14.27) v1(24.36,11.27) v1(24.36,8.27) v1(24.36,5.27) v1(24.36,2.27) v1(26.65,20.13) v1(27.36,14.27) v1(27.36,11.27) v1(27.36,8.27) v1(27.36,5.27) v1(27.36,2.27) v1(28.96,25.81) v1(29.08,20.06) v1(30.36,11.27) v1(30.36,8.27) v1(30.36,5.27) v1(30.36,2.27) v1(30.87,18.82) v1(33.1,25.81) v1(33.4,18.9) v1(33.36,8.27) v1(33.36,5.27) v1(33.36,2.27) v1(35.47,25.81) v1(36.36,17.27) v1(36.36,5.27) v1(36.36,2.27) v1(37.96,25.81) v1(39.36,8.27) v1(39.36,2.27) v1(40.03,11.13) v1(40.12,13.47) v1(40.29,9.59) v1(42.36,2.27) v1(42.55,25.78) v1(43.68,19.23) v1(43.74,17.8) v1(43.73,14.55) v1(43.99,10.82) v1(44.01,9.73) v1(44.3,12.65) v1(44.94,19) v1(45.36,2.27) v1(46.22,19.07) v1(46.28,12.72) v1(46.36,25.78) v1(46.5,9.79) v1(48.36,5.27) v1(48.36,2.27) v1(48.67,19.09) v1(48.98,11.07) v1(49.96,25.81) v1(51.36,2.27) v1(52.96,25.81) v1(53.25,11.34) v1(53.27,14.8) v1(53.33,9.7) v1(54.36,17.27) v1(54.36,2.27) v1(54.64,18.9) v1(54.83,13.47) v1(55.96,25.81) v1(57.36,2.27) v1(58.96,25.81) v1(60.29,18.86) v1(60.36,2.27) v1(60.49,14.27) v1(61.71,25.81) v1(63.36,2.27) v1(63.5,25.78) v1(64.19,14.69) v1(64.68,18.98) v1(65.21,25.81) v1(66.36,2.27) v1(67.51,19.12) v1(69.36,2.27) v1(70.87,11.08) v1(70.96,25.81) v1(71.04,16.41) v1(70.96,9.69) v1(71.4,14.81) v1(72.36,5.27) v1(72.36,2.27) v1(73.14,12.98) v1(73.22,19.02) v1(73.96,25.81) v1(75.36,5.27) v1(75.36,2.27) v1(76.58,25.81) v1(78.36,5.27) v1(78.36,2.27) v1(79.96,25.81) v1(80.99,19.12) v1(80.98,12.21) v1(81.14,15.54) v1(81.36,5.27) v1(81.36,2.27) v1(82.96,25.81) v1(83.92,11.66) v1(84.25,15.72) v1(84.36,5.27) v1(84.36,2.27) v1(84.51,19.16) v1(84.64,13.57) v1(85.96,25.81) v1(87.36,5.27) v1(87.36,2.27) v1(88.58,25.81) v1(88.71,13.47) v1(89.65,8.93) v1(90.36,17.27) v1(90.36,5.27) v1(90.36,2.27) v1(91.96,25.81) v1(93.36,17.27) v1(93.36,5.27) v1(93.36,2.27) v1(95.46,18.97) v1(95.59,25.81) v1(96.36,14.27) v1(96.36,5.27) v1(96.36,2.27) v1(97.16,16.21) v1(97.76,19.01) v1(97.96,25.81) v1(99.36,14.27) v1(99.36,5.27) v1(99.36,2.27) v1(99.57,16.13) v1(100.2,9.02) v1(100.96,25.81) v1(101.38,19.1) v1(102.36,14.27) v1(102.36,5.27) v1(102.36,2.27) v1(103.85,11.96) v1(103.96,25.81) v1(105.36,17.27) v1(105.36,14.27) v1(105.36,2.27) v1(106.2,25.81) v1(107.39,12.87) v1(108.36,2.27) v1(108.56,25.81) v1(109.05,7.22) v1(110.22,12.18) v1(111.36,2.27) v1(112.96,25.81) v1(113.67,4.94) v1(113.7,3.75) v1(114.36,8.27) v1(114.36,2.27) v1(114.54,15.9) v1(114.67,19.14) v1(115.78,12.87) v1(115.96,25.81) v1(116.89,10.13) v1(117.2,19.04) v1(117.28,15.81) v1(117.36,2.27) v1(118.96,25.81) v1(119.1,21.22) v1(120.36,2.27) v1(121.96,25.81) v1(123.13,14.79) v1(123.32,13.54) v1(123.25,11.44) v1(123.36,17.27) v1(123.36,2.27) v1(124.33,25.78) v1(124.57,5.46) v1(126.31,25.81) v1(126.36,17.27) v1(126.36,2.27) v1(127.96,25.81) v1(129.36,17.27) v1(129.36,2.27) v1(131.21,25.81) v1(131.55,18.99) v1(132.36,2.27) v1(132.72,17.63) v1(133.72,16.73) v1(133.96,25.81) v1(135.36,5.27) v1(135.36,2.27) v1(135.89,19.04) v1(135.89,16.81) v1(136.96,25.81) v1(138.36,8.27) v1(138.36,5.27) v1(138.36,2.27) v1(138.65,18.69) v1(139.96,25.81) v1(141.36,11.27) v1(141.36,8.27) v1(141.36,5.27) v1(141.36,2.27) v1(142.96,25.81) v1(144.36,14.27) v1(144.36,11.27) v1(144.36,8.27) v1(144.36,5.27) v1(144.36,2.27) v1(145.96,25.81) v1(147.42,18.5) v1(147.36,14.27) v1(147.36,11.27) v1(147.36,8.27) v1(147.36,5.27) v1(147.36,2.27) v1(148.96,25.81) v1(150.36,14.27) v1(150.36,11.27) v1(150.36,8.27) v1(150.36,5.27) v1(150.36,2.27) v1(151.96,25.81)
$RELAY1_7: length 19.8
  Top Layer w0.254: 94.65,27.6 94.62,27.57 94.62,17.27 91.48,14.13 U7.16
$RELAY1_12: length 36
  Top Layer w0.254: 94.65,40.3 96.78,38.17 96.78,17.39 92.2,12.82 86.52,12.82 U7.15
$RELAY2_7: length 20.1
  Top Layer w0.254: 113.59,19.91 113.56,19.91 ; 113.56,19.91 113.79,19.68 113.79,15.74 113.45,15.4 112.01,15.4 ; 113.56,19.91 110.27,19.91 109.41,20.77 108.31,20.77 104.81,24.27 RELAY2.7
$RELAY2_12: length 44.6
  Top Layer w0.254: v1(107.32,22.73) 107.32,39.49 106.52,40.28 RELAY2.12 ; 86.47,15.4 86.52,15.36 v1(91.06,15.36) ; v1(105.66,21.84) 105.66,20.44 100.59,15.36 v1(96.14,15.36)
  Bottom Layer w0.254: v1(105.66,21.84) 105.66,22.35 106.05,22.73 v1(107.32,22.73) ; v1(96.14,15.36) v1(91.06,15.36)
$RELAY3_7: length 20.9
  Top Layer w0.254: RELAY3.7 114.97,23.97 115.57,23.36 115.57,15.99 114.36,14.78 110.65,14.78 110.24,14.37 110.24,13.33 110.7,12.86 U6.6
$RELAY3_12: length 31.1
  Top Layer w0.254: U6.5 114.85,14.13 116.33,15.62 116.33,23.62 117.48,24.76 117.48,37.77 RELAY3.12
$RELAY4_7: length 23.8
  Top Layer w0.254: v1(119.51,11.58) 121.46,11.58 U6.14 ; v1(117.73,12.69) 118.11,13.08 118.11,21.2 121.79,24.89 124.59,24.89 125.12,25.42 RELAY4.7
  Bottom Layer w0.254: v1(119.51,11.58) 118.84,11.58 v1(117.73,12.69)
$RELAY4_12: length 41.3
  Top Layer w0.254: RELAY4.12 127.25,38.15 127.25,25.39 124.72,22.85 121.79,22.85 119.13,20.19 119.13,12.31 118.41,11.59 U6.7
$RELAY5_7: length 26
  Top Layer w0.254: 135.24,27.62 135.29,27.57 135.29,17.3 130.85,12.86 U6.15
$RELAY5_12: length 40.8
  Top Layer w0.254: v1(133.73,17.77) 130.09,14.13 U6.16 ; RELAY5.12 137.69,37.88 137.69,22 137.03,21.34 v1(137.03,17.9)
  Bottom Layer w0.254: v1(137.03,17.9) 136.91,17.77 v1(133.73,17.77)
$RELAY6_7: length 75.1
  Top Layer w0.254: U7.14 88.76,11.59 89.18,12.02 102.53,12.02 v1(104.14,10.41) ; RELAY6.7 145.29,27.47 145.29,22.09 142.75,19.55 141.48,19.55 126.26,4.34 110.21,4.34 v1(107.44,7.11)
  Bottom Layer w0.254: v1(107.44,7.11) v1(104.14,10.41)
$RELAY6_12: length 106.4
  Top Layer w0.254: v1(103.14,10.03) 102.19,10.98 82.95,10.98 82.34,11.59 U7.7 ; RELAY6.12 149.99,35.69 149.99,19.93 147.58,17.52 143.51,17.52 129.16,3.17 v1(112.52,3.17)
  Bottom Layer w0.254: v1(103.14,10.03) 106.83,6.34 110.62,6.34 112.52,4.44 v1(112.52,3.17)
$RELAY7_7: length 19
  Top Layer w0.254: RELAY7.7 62.53,22.64 55.29,15.4 51.47,15.4
$RELAY7_12: length 36.1
  Top Layer w0.254: RELAY7.12 64.52,38.33 64.52,20.95 57.7,14.13 U8.16
$RELAY8_7: length 17.5
  Top Layer w0.254: RELAY8.7 52.37,26.2 49.53,23.36 49.53,13.58 50.25,12.86 U8.15
$RELAY8_12: length 35.1
  Top Layer w0.254: RELAY8.12 53.85,38.84 53.85,30.09 52.71,28.95 51.69,28.95 47.75,25.01 47.75,13.46 49.62,11.59 U8.14
$RELAY9_7: length 20.2
  Top Layer w0.254: RELAY9.7 45.52,24.3 45.52,12.88 44.24,11.59 U8.7
$RELAY9_12: length 34.4
  Top Layer w0.254: RELAY9.12 44.2,38.33 44.2,29.84 43.18,28.82 41.02,28.82 40.64,28.44 40.64,26.03 44.32,22.35 44.32,13.71 43.48,12.86 U8.6
$RELAY10_7: length 21
  Top Layer w0.254: U8.5 36.15,14.13 32.05,18.23 RELAY10.7
$RELAY10_12: length 32
  Top Layer w0.254: 42.01,15.4 36.92,15.4 34.29,18.03 34.29,38.08 RELAY10.12
$RELAY11_7: length 26.8
  Top Layer w0.254: 77.01,15.4 75.57,15.4 75.31,15.15 75.31,13.84 75.69,13.46 79.38,13.46 80.27,14.35 80.27,23.13 75.81,27.59 RELAY11.7
$RELAY11_12: length 42.6
  Top Layer w0.254: v1(69.98,33.01) 69.98,32.38 68.96,31.36 66.55,31.36 65.79,30.6 65.79,29.59 66.42,28.95 69.34,28.95 69.98,28.32 69.98,25.39 70.87,24.51 75.82,24.51 78.49,21.84 78.49,16.88 78.97,16.4 78.97,15.32 79.2,15.1 79.2,14.61 78.86,14.27 78.5,14.27 78.23,14.01 77.14,14.01 U7.5
  Bottom Layer w0.254: v1(69.98,33.01) 69.98,37.57 RELAY11.12
$U6_18: length 49.4
  Top Layer w0.254: v1(78.61,14.85) 78.61,16.25 78.19,16.67 U7.3 ; v1(93.47,12.82) NOREF#5.TP6 105.92,12.82 v1(108.59,15.49) ; U6.18 v1(119.76,16.67)
  Bottom Layer w0.254: v1(78.61,14.85) 78.61,13.33 79.12,12.82 v1(93.47,12.82) ; v1(119.76,16.67) 109.77,16.67 v1(108.59,15.49)
$U7_18: length 47.6
  Top Layer w0.254: U7.18 v1(81.32,16.67) ; v1(72.39,15.49) NOREF#2.TP7 63.63,15.49 60.96,12.82 v1(53.72,12.82) ; 42.01,16.67 v1(43.67,16.67)
  Bottom Layer w0.254: v1(53.72,12.82) 47.52,12.82 v1(43.67,16.67) ; v1(72.39,15.49) 74.3,15.49 75.48,16.67 v1(81.32,16.67)
CLK: length 173.4
  Top Layer w0.254: v1(101.6,9.77) 89.79,9.77 89.24,10.32 U7.13 86.45,10.3 v1(81.89,10.3) ; v1(47.25,5.46) 46.86,5.07 37.72,5.07 33.56,9.23 8.42,9.23 3.43,14.22 3.43,45.46 3.75,45.78 7.84,45.78 ; v1(47.25,8.63) 48.94,10.32 U8.13 71.46,10.32 v1(72.95,11.81) ; U6.13 123.15,10.32 124.08,9.39 124.08,7.23 122.37,5.52 110.18,5.52 v1(110.11,5.46)
  Bottom Layer w0.254: v1(110.11,5.46) 106.43,5.46 102.11,9.77 v1(101.6,9.77) ; v1(72.95,11.81) 80.38,11.81 v1(81.89,10.3) ; v1(47.25,5.46) v1(47.25,8.63)
CT: length 1.9
  Top Layer w0.254: C5.1 19.26,31.08 U13.4
DATA: length 164.4
  Top Layer w0.254: U6.3 111.97,16.63 110.67,16.63 109.35,15.31 109.35,10.03 103.12,3.8 36.13,3.8 32.7,7.23 NOREF#3.TP5 8.51,7.23 2.16,13.58 v1(2.16,21.58) 2.16,49.4 3.62,50.86 7.84,50.86
HI-1: length 27.4
  Top Layer w0.6: CN2.1 26.97,44.27 28.17,43.07 28.17,33.9 RELAY10.4
HI-2: length 27.4
  Top Layer w0.6: RELAY9.4 38.33,33.9 38.33,43.07 37.13,44.27 CN2.3
HI-3: length 27.4
  Top Layer w0.6: 47.29,58.99 47.29,44.11 48.49,42.91 48.49,33.74 47.29,32.54
HI-4: length 27.4
  Top Layer w0.6: CN2.7 57.45,44.27 58.65,43.07 58.65,33.9 RELAY7.4
HI-5: length 27.4
  Top Layer w0.6: 67.61,32.7 68.81,33.9 68.81,43.07 67.61,44.27 CN2.9
HI-6: length 27.4
  Top Layer w0.6: CN3.1 89.56,44.27 90.77,43.07 90.77,33.9 89.56,32.7
HI-7: length 27.4
  Top Layer w0.6: CN3.3 99.72,44.27 100.93,43.07 100.93,33.9 99.72,32.7
HI-8: length 27.4
  Top Layer w0.6: 109.88,32.7 111.09,33.9 111.09,43.07 109.88,44.27 CN3.5
HI-9: length 27.4
  Top Layer w0.6: 120.05,32.7 121.25,33.9 121.25,43.07 120.05,44.27 CN3.7
HI-10: length 27.4
  Top Layer w0.6: 130.21,32.7 131.41,33.9 131.41,43.07 130.21,44.27 CN3.9
HI-A: length 160
  Top Layer w0.6: CN2.11 77.77,33.57 75.57,31.37 71,31.37 69.76,30.13 RELAY11.5
  Bottom Layer w0.6: RELAY10.5 28.18,31.36 35.92,31.36 RELAY9.5 37.91,30.16 39.12,31.36 46.08,31.36 RELAY8.5 47.82,30.16 49.02,31.36 56.24,31.36 RELAY7.5 58.36,30.16 59.56,31.36 66.37,31.36 RELAY11.5 68.85,31.36 80.9,31.36 88.14,38.6 137.92,38.6 140.32,36.21 RELAY6.3
HI-B: length 30
  Top Layer w0.6: CN3.11 140.37,44.27 141.52,43.12 141.52,31.33 RELAY6.5
HI_B_R: length 56.1
  Bottom Layer w0.6: RELAY6.4 139.02,31.36 132.21,31.36 130.96,30.12 RELAY5.5 128.96,31.36 123.06,31.36 121.82,30.12 RELAY4.5 118.71,31.46 112.75,31.46 111.41,30.12 RELAY3.5 108.64,31.36 101.86,31.36 100.61,30.12 RELAY2.5 98.37,31.47 90.9,31.47 RELAY1.5
ID: length 6.2
  Top Layer w0.254: 13.84,23.49 12.44,23.49 11.87,22.92 NOREF#4.TP3 CN1.20
LO-1: length 27.4
  Top Layer w0.6: RELAY10.9 30.85,33.9 30.85,43.03 32.05,44.23 CN2.2
LO-2: length 27.4
  Top Layer w0.6: RELAY9.9 41.01,33.9 41.01,43.03 42.21,44.23 CN2.4
LO-3: length 27.4
  Top Layer w0.6: 52.37,32.54 51.17,33.74 51.17,42.87 52.37,44.08 52.37,58.99
LO-4: length 27.4
  Top Layer w0.6: RELAY7.9 61.33,33.9 61.33,43.03 62.53,44.23 CN2.8
LO-5: length 27.4
  Top Layer w0.6: 72.69,32.7 71.49,33.9 71.49,43.03 72.69,44.23 CN2.10
LO-6: length 27.4
  Top Layer w0.6: 94.65,32.7 93.44,33.9 93.44,43.03 94.65,44.23 CN3.2
LO-7: length 27.4
  Top Layer w0.6: CN3.4 104.81,44.23 103.6,43.03 103.6,33.9 104.81,32.7
LO-8: length 27.4
  Top Layer w0.6: CN3.6 114.97,44.23 113.76,43.03 113.76,33.9 114.97,32.7
LO-9: length 27.4
  Top Layer w0.6: 125.12,32.7 123.92,33.9 123.92,43.03 125.12,44.23 CN3.8
LO-10: length 27.4
  Top Layer w0.6: CN3.10 135.28,44.23 134.08,43.03 134.08,33.9 135.28,32.7
LO-A: length 160.9
  Top Layer w0.6: RELAY11.8 72.78,30.22 81.15,30.22 82.85,31.92 CN2.12
  Bottom Layer w0.6: RELAY11.8 71.49,28.92 64.54,28.92 63.31,30.16 RELAY7.8 61.32,28.95 54.87,28.95 53.66,30.16 RELAY8.8 51.16,28.95 43.94,28.95 42.74,30.16 RELAY9.8 41,28.95 33.26,28.95 RELAY10.8 ; RELAY6.10 144.1,33.9 138.71,33.9 137.92,34.69 137.92,36.06 136.91,37.08 88.9,37.08 82.02,30.2 72.77,30.2
LO-B: length 30
  Top Layer w0.6: CN3.12 145.44,44.23 144.2,42.99 144.2,31.33 RELAY6.8
LO_B_R: length 57.4
  Bottom Layer w0.6: RELAY6.9 145.4,32.36 141.86,28.82 138.81,28.82 137.52,30.12 RELAY5.8 133.99,28.82 127.25,28.82 125.96,30.12 RELAY4.8 123.83,28.82 116.97,28.82 115.67,30.12 RELAY3.8 113.67,28.82 106.68,28.82 105.38,30.12 RELAY2.8 103.51,28.82 97.03,28.82 95.72,30.14 94.65,30.14
NRST: length 21.1
  Top Layer w0.254: CN1.9 CN1.25 NOREF.TP1 18.73,35.62 21.96,32.39 U13.3
OE/RST_OUT: length 109.2
  Top Layer w0.254: U6.8 U6.9 111.97,9.01 v1(109.47,9.01) ; v1(26.04,22.35) 26.04,22.15 37.87,10.32 U8.8 U8.9 46,9.05 49.09,5.96 70.61,5.96 74.97,10.32 U7.8 U7.9 80.22,9.05 82.81,6.47 104.01,6.47 v1(106.55,9.01) ; v1(23.75,22.35) 23.74,22.36 NOREF#7.TP4 R14.1 U13.1
  Bottom Layer w0.254: v1(26.04,22.35) v1(23.75,22.35) ; v1(106.55,9.01) v1(109.47,9.01)
SENSE: length 3.8
  Top Layer w0.254: U13.5 18.18,28.3 17.87,28.6 R12.2 17.03,27.16 R9.1
STROBE: length 145.3
  Top Layer w0.254: v1(47.88,8.12) 48.81,9.05 U8.12 71.54,9.05 73.44,10.95 79.94,10.95 81.84,9.05 U7.12 88.35,9.05 89.28,8.12 103.25,8.12 105.03,9.9 v1(107.82,9.9) ; v1(109.98,9.9) 109.98,10.28 110.62,10.92 113.67,10.92 115.53,9.05 U6.12 ; v1(47.88,6.22) 39.18,6.22 25.02,20.37 25.02,34.79 NOREF#6.TP2 19.13,40.68 9.76,40.68 9.74,40.7 CN1.27 CN1.11
  Bottom Layer w0.254: v1(47.88,6.22) v1(47.88,8.12) ; v1(107.82,9.9) v1(109.98,9.9)

## Copper pours and planes (outline as drawn; the poured copper is in the pictures)
+5V on Top Layer: 4.03,33.85 4.04,33.96 4.09,34.09 4.18,34.2 4.29,34.29 4.42,34.34 4.53,34.35 15,34.35 15.1,34.34 15.23,34.29 15.35,34.2 15.43,34.09 15.48,33.96 15.5,33.85 15.5,24.75 15.48,24.65 15.43,24.51 15.35,24.4 15.23,24.31 15.1,24.26 15,24.25 4.53,24.25 4.42,24.26 4.29,24.31 4.18,24.4 4.09,24.51 4.04,24.65 4.03,24.75
GND on Top Layer: 0.13,26.19 152.4,26.19 152.4,-7.08 0.13,-7.08
GND on Top Layer: -0.12,68.61 24.67,68.61 24.67,-0.98 -0.12,-0.98
GND on Bottom Layer: 0,25.66 0.01,25.76 0.06,25.9 0.15,26.01 0.26,26.1 0.39,26.15 0.5,26.16 151.9,26.16 152.01,26.15 152.14,26.1 152.25,26.01 152.34,25.9 152.39,25.76 152.4,25.66 152.4,0.32 152.39,0.21 152.34,0.08 152.25,-0.04 152.14,-0.12 152.01,-0.17 151.9,-0.18 0.5,-0.18 0.39,-0.17 0.26,-0.12 0.15,-0.04 0.06,0.08 0.01,0.21 0,0.32
GND on Bottom Layer: -0.25,67.9 -0.24,68.01 -0.19,68.14 -0.11,68.26 0.01,68.34 0.14,68.39 0.25,68.4 24.14,68.4 24.24,68.39 24.37,68.34 24.49,68.26 24.57,68.14 24.62,68.01 24.64,67.9 24.64,-0.52 24.62,-0.63 24.57,-0.76 24.49,-0.88 24.37,-0.96 24.24,-1.01 24.14,-1.02 0.25,-1.02 0.14,-1.01 0.01,-0.96 -0.11,-0.88 -0.19,-0.76 -0.24,-0.63 -0.25,-0.52

Small or netless copper shapes (teardrops, artwork), in the pictures only: 216 on Top Layer, 121 on Bottom Layer

## Text on the board
Bottom Silkscreen Layer: Designed by: / Arwid Vasilev / github.com/arwidcool / PCB Outline By: / Patrick Baus
Top Silkscreen Layer: GND | 5V | ID | V1.0 | Replacement | WARNING!!! | H | CH1 | L | CH2 | CH3 | CH4 | CH5 | OUT A | CH6 | CH7 | CH8 | CH9 | CH10 | OUT B | MAX 200VDC / 125VAC / 1A / VOLTAGE & RESISTANCE ONLY / 220V TO EARTH MAXIMUM
